# EAGLE design jar-of-fireflies (EAGLE 7.6.0)
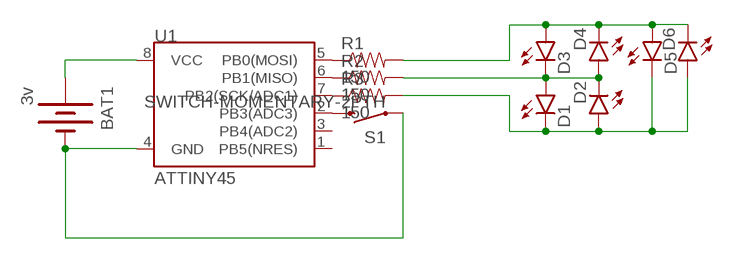
[diagram p0: schematic, sheet 1]

## Parts
BAT1  3v  BATTERY20PTH  [BATTCOM_20MM_PTH]
D1  LED3MM  [LED3MM]
D2  LED3MM  [LED3MM]
D3  LED3MM  [LED3MM]
D4  LED3MM  [LED3MM]
D5  LED3MM  [LED3MM]
D6  LED3MM  [LED3MM]
R1  150  RESISTORPTH-1/4W  [AXIAL-0.4]
R2  150  RESISTORPTH-1/4W  [AXIAL-0.4]
R3  150  RESISTORPTH-1/4W  [AXIAL-0.4]
S1  SWITCH-MOMENTARY-2PTH  [TACTILE-PTH]
U1  ATTINY45  ATTINY45TINY85-20-DIP  [DIP08]

## Nets
GND: BAT1.2(-) S1.1 U1.4(GND)
N$1: R1.P$1 U1.5(PB0(MOSI))
N$2: R2.P$1 U1.6(PB1(MISO))
N$3: R3.P$1 U1.7(PB2(SCK/ADC1))
N$4: S1.3 U1.2(PB3(ADC3))
N$6: D3.A D4.K(C) D5.A D6.K(C) R1.P$2
N$7: D1.K(C) D2.A D5.K(C) D6.A R3.P$2
N$8: D1.A D2.K(C) D3.K(C) D4.A R2.P$2
VCC: BAT1.1(+) U1.8(VCC)
Unconnected: U1.1(PB5(NRES)) U1.3(PB4(ADC2))

## Library data of the parts
BAT1 = SparkFun-Electromechanical:BATTERY: Battery Holders Various common sizes : AA, AAA, 18650 (PRT-12895), 20mm coin cell and 12mm coin cell. 20MM_4LEGS, BATT-10373
D1-D6 = SparkFun-LED:LED: LEDs Standard schematic elements and footprints for 5mm, 3mm, 1206, and 0603 sized LEDs. 5mm - Spark Fun Electronics SKU : COM-00529 (and others)
R1-R3 = SparkFun-Passives:RESISTOR: Resistor Basic schematic elements and footprints for 0603, 1206, and PTH resistors.
S1 = SparkFun-Electromechanical:SWITCH-MOMENTARY-2: Various NO switches- pushbuttons, reed, etc; PROD_ID: SWCH-08441
U1 = SparkFun-DigitalIC:ATTINY45: Atmel 8-pin 2/4/8kB flash uC; PROD_ID: IC-09445; VALUE: TINY85-20-DIP

## Board
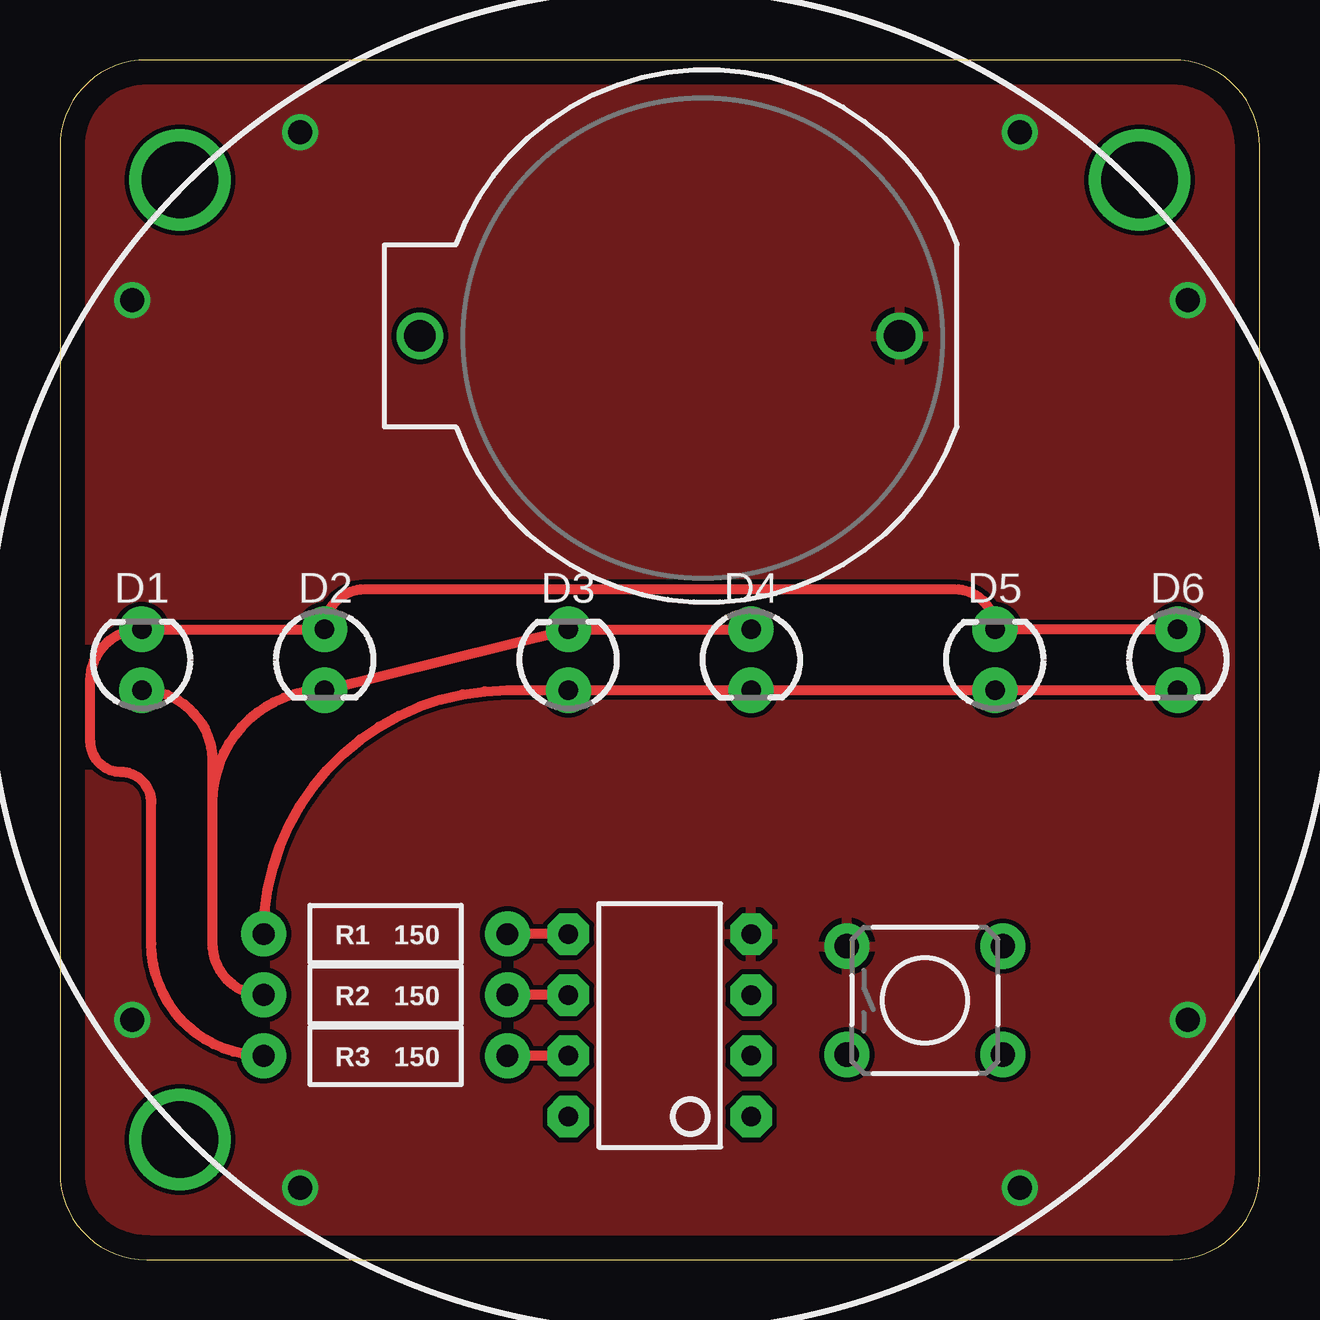
[diagram p1: board, top side]
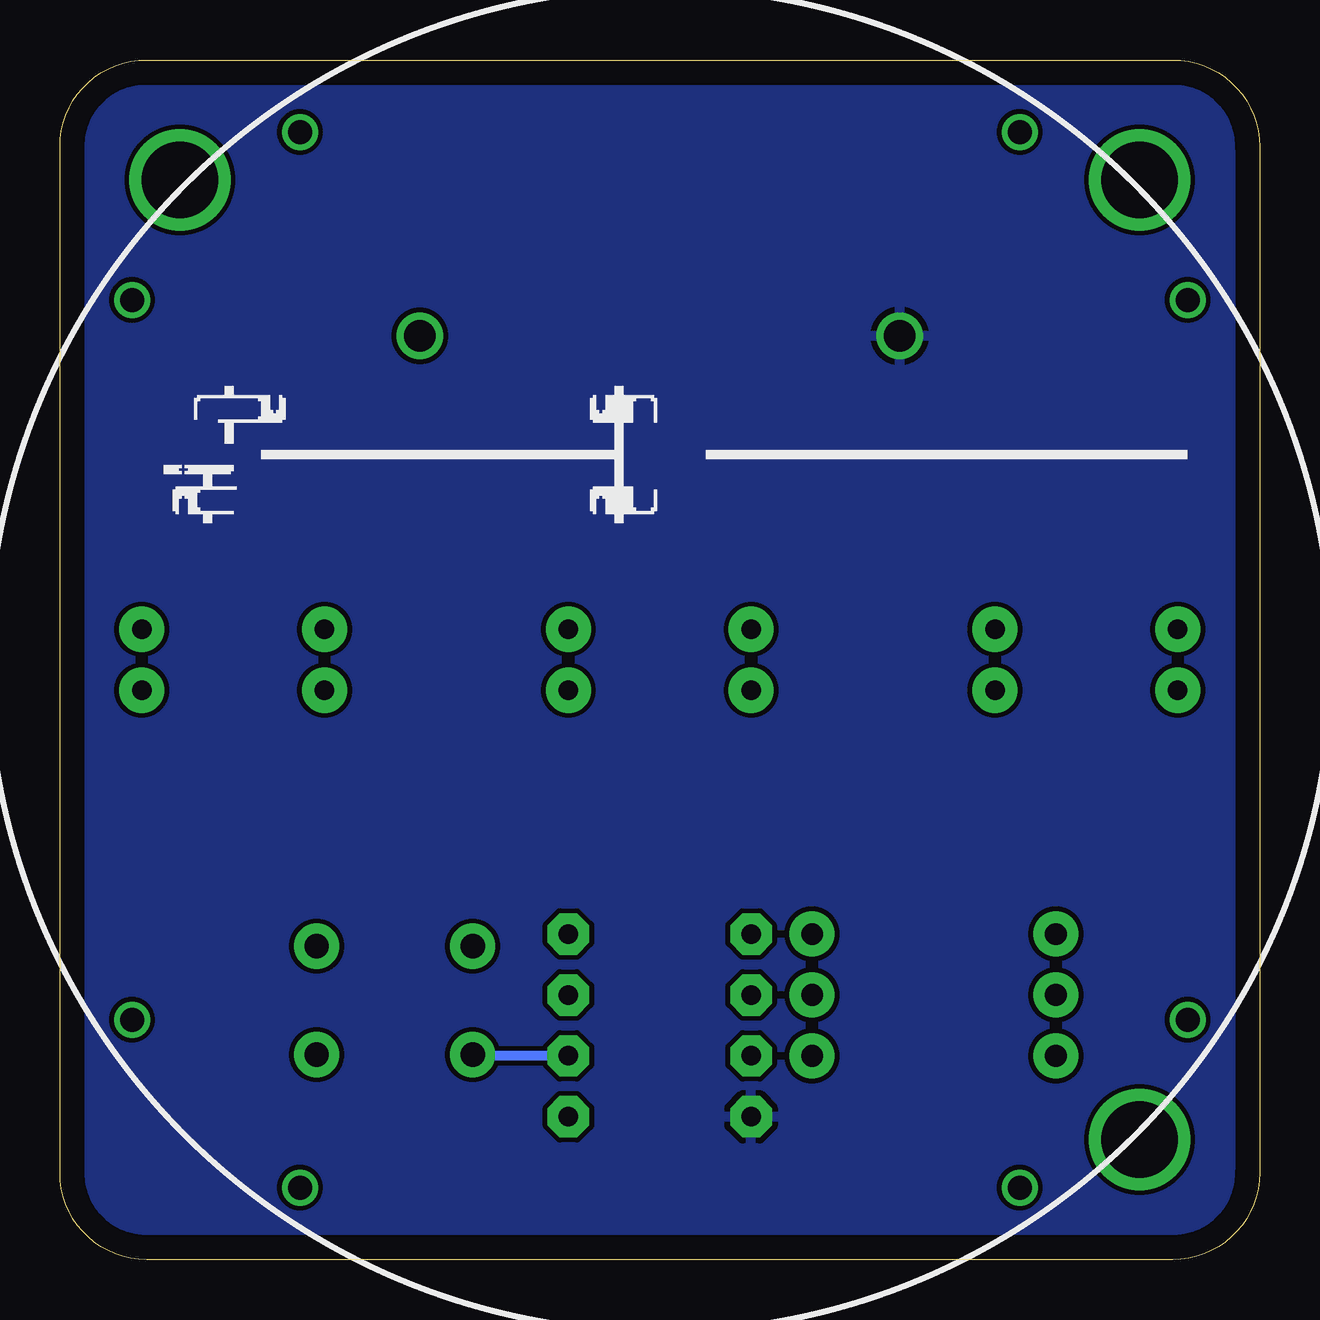
[diagram p2: board, bottom side, seen from below]

Size 50 x 50 mm. Coordinates in mm from the lower left corner, seen from the top.
Outline: 0,46.39 0,3.61 arc90 3.61,0 46.39,0 arc90 50,3.61 50,46.39 arc90 46.39,50 3.61,50 arc90 0,46.39
Copper layers (1*16): Top 0.035mm / dielectric 1.5mm / Bottom 0.035mm
Design rules "default": minimum track width 10mil, minimum drill 24mil, track to track 8mil, track to pad 8mil, pad to pad 8mil, via to via 8mil, smd to smd 8mil, copper to edge 40mil, drill to drill 8mil, minimum pad ring 10mil, minimum via ring 8mil, stop-mask expansion 4mil, vias tented up to drill 0mil, thermal gap 10mil

### Footprints (pad centres in the part's own frame; a part is rotated, then mirrored left to right if it is on the bottom)
BATTCOM_20MM_PTH = drill 1.3: 1 11.85,0; 2 -8.15,0
LED3MM = drill 0.813 pad 1.88: A -1.27,0; K 1.27,0
AXIAL-0.4 = drill 0.9 pad 1.88: P$1 -5.08,0; P$2 5.08,0
TACTILE-PTH = drill 1.016 pad 1.88: 1 -3.251,2.261; 2 3.251,2.261; 3 -3.251,-2.261; 4 3.251,-2.261
DIP08 = drill 0.813 pad 1.727 octagon: 1 -3.81,-3.81; 2 -1.27,-3.81; 3 1.27,-3.81; 4 3.81,-3.81; 5 3.81,3.81; 6 1.27,3.81; 7 -1.27,3.81; 8 -3.81,3.81

### Placement (x,y rotation side)
BAT1  26.85,38.5 180 top
D1  3.41,25 90 top
D2  11.03,25 270 top
D3  21.19,25 90 top
D4  28.81,25 270 top
D5  38.97,25 90 top
D6  46.59,25 270 top
R1  13.57,13.57 180 top
R2  13.57,11.03 180 top
R3  13.57,8.49 180 top
S1  36.05,10.8 0 top
U1  25,9.76 90 top
U$1  [SECURINGHARDWAREDOTCOM]  46,30 0 bottom
U$2  [FIREFLY]  7.62,27.94 45 top
U$3  [FIREFLY]  21.59,35.56 0 top
U$4  [FIREFLY]  36.83,33.02 315 top
U$5  [FIREFLY]  17.5,7 0 bottom
U$6  [FIREFLY]  40.5,7 0 bottom

### Tracks (layer width: path | path; a pad name or v marks a point on that pad's centre or on a via)
GND  (via drill 1)
  other vias: 3,40 10,3 47,10 40,47 47,40 10,47 3,10 40,3
  pour Top: 0,0 52.07,0 52.07,50.8 0,50.8
N$1
  Top 0.406: U1.5 R1.P$1
N$2
  Top 0.406: U1.6 R2.P$1
N$3
  Top 0.406: U1.7 R3.P$1
N$4
  Bottom 0.406: U1.2 32.8,8.49 S1.3
N$6
  Top 0.406: D6.K D5.A D4.K D3.A 18.65,23.73 arc90 R1.P$2
N$7
  Top 0.406: D6.A D5.K arc90 37.3,27.94 12.7,27.94 arc90 D2.A D1.K arc90 1.27,24.13 1.27,21.59 arc90 2.54,20.32 arc-90 3.81,19.05 3.81,13.17 arc90 R3.P$2
N$8
  Top 0.406: D4.A D3.K D2.K arc90 6.35,19.05 | 6.35,19.05 6.35,17.78 6.35,13.17 arc90 R2.P$2 | D1.A arc-90 6.35,20.79 6.35,19.05
N$9  (via drill 3.2)
  other vias: 5,5
N$10  (via drill 3.2)
  other vias: 5,45
N$12  (via drill 3.2)
  other vias: 45,45
VCC
  pour Bottom: 0,0 52.07,0 52.07,50.8 0,50.8

### Text on the board
bStop: Joe FitzPatrick / @securelyfitz | joefitz@securinghardware.com | Jar of Fireflies
tDocu: Jar of Fireflies V1.2 / https://git.io/fireflies | by @securelyfitz